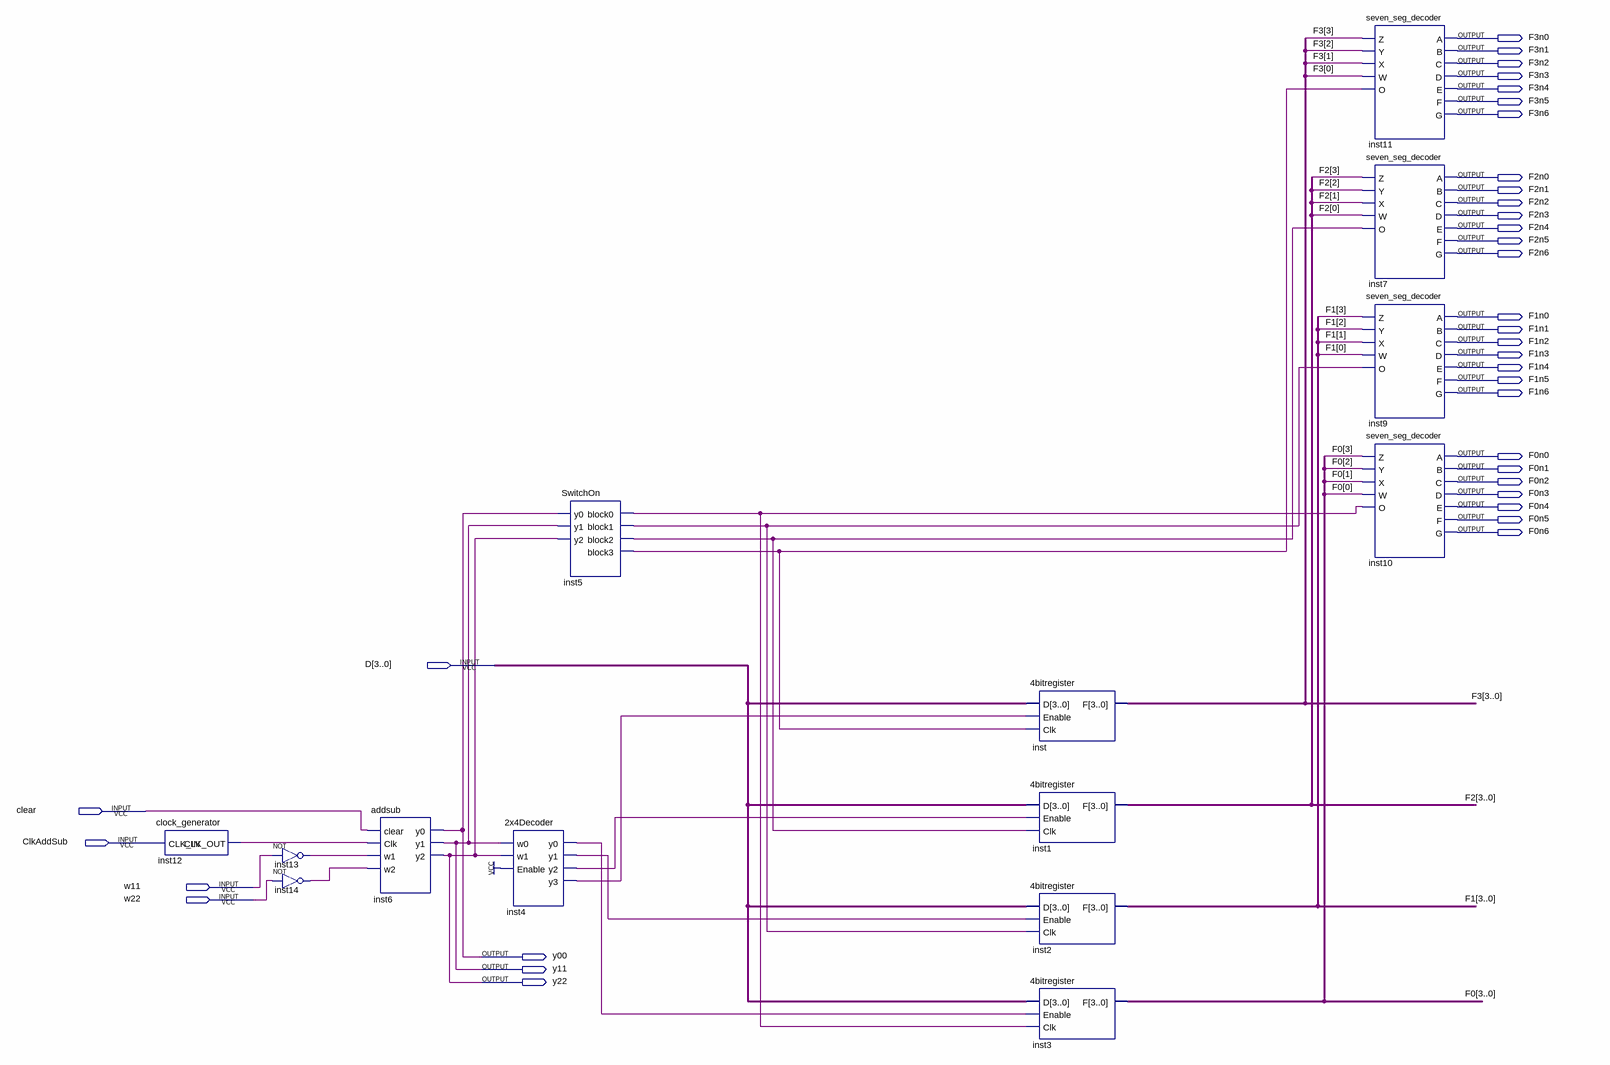
[diagram p0: schematic sheet]
// Quartus schematic projectN28.bdf as structural Verilog: 14 symbols, 36 pins
module projectN28 (
  input  [3:0] D,
  input  clear,
  input  ClkAddSub,
  input  w11,
  input  w22,
  output F3n0,
  output F3n1,
  output F3n2,
  output F3n3,
  output F3n4,
  output F3n5,
  output F3n6,
  output F2n0,
  output F2n1,
  output F2n2,
  output F2n3,
  output F2n4,
  output F2n5,
  output F2n6,
  output F1n0,
  output F1n1,
  output F1n2,
  output F1n3,
  output F1n4,
  output F1n5,
  output F1n6,
  output F0n0,
  output F0n1,
  output F0n2,
  output F0n3,
  output F0n4,
  output F0n5,
  output F0n6,
  output y00,
  output y11,
  output y22
);

  wire inst4_y0, inst4_y1, inst4_y2, inst4_y3, inst5_block0, inst5_block1, inst5_block2, inst5_block3,
       inst12_clk_out, inst13_out, inst14_out;
  wire [3:0] F0, F1, F2, F3;

  clock_generator inst12 (.CLK_IN(ClkAddSub), .CLK_OUT(inst12_clk_out));
  not inst13 (inst13_out, w11);
  not inst14 (inst14_out, w22);
  addsub inst6 (.clear(clear), .Clk(inst12_clk_out), .w1(inst13_out), .w2(inst14_out), .y0(y00), .y1(y11), .y2(y22));
  \2x4Decoder  inst4 (.w0(y11), .w1(y22), .Enable(1'b1), .y0(inst4_y0), .y1(inst4_y1), .y2(inst4_y2), .y3(inst4_y3));
  SwitchOn inst5 (
    .y0(y00), .y1(y11), .y2(y22), .block0(inst5_block0), .block1(inst5_block1), .block2(inst5_block2),
    .block3(inst5_block3));
  \4bitregister  inst (.D(D), .Enable(inst4_y3), .Clk(inst5_block3), .F(F3));
  \4bitregister  inst1 (.D(D), .Enable(inst4_y2), .Clk(inst5_block2), .F(F2));
  \4bitregister  inst2 (.D(D), .Enable(inst4_y1), .Clk(inst5_block1), .F(F1));
  \4bitregister  inst3 (.D(D), .Enable(inst4_y0), .Clk(inst5_block0), .F(F0));
  seven_seg_decoder inst11 (
    .Z(F3[3]), .Y(F3[2]), .X(F3[1]), .W(F3[0]), .O(inst5_block3), .A(F3n0), .B(F3n1), .C(F3n2), .D(F3n3),
    .E(F3n4), .F(F3n5), .G(F3n6));
  seven_seg_decoder inst7 (
    .Z(F2[3]), .Y(F2[2]), .X(F2[1]), .W(F2[0]), .O(inst5_block2), .A(F2n0), .B(F2n1), .C(F2n2), .D(F2n3),
    .E(F2n4), .F(F2n5), .G(F2n6));
  seven_seg_decoder inst9 (
    .Z(F1[3]), .Y(F1[2]), .X(F1[1]), .W(F1[0]), .O(inst5_block1), .A(F1n0), .B(F1n1), .C(F1n2), .D(F1n3),
    .E(F1n4), .F(F1n5), .G(F1n6));
  seven_seg_decoder inst10 (
    .Z(F0[3]), .Y(F0[2]), .X(F0[1]), .W(F0[0]), .O(inst5_block0), .A(F0n0), .B(F0n1), .C(F0n2), .D(F0n3),
    .E(F0n4), .F(F0n5), .G(F0n6));
endmodule
